# EAGLE design node (EAGLE 6.5.0)
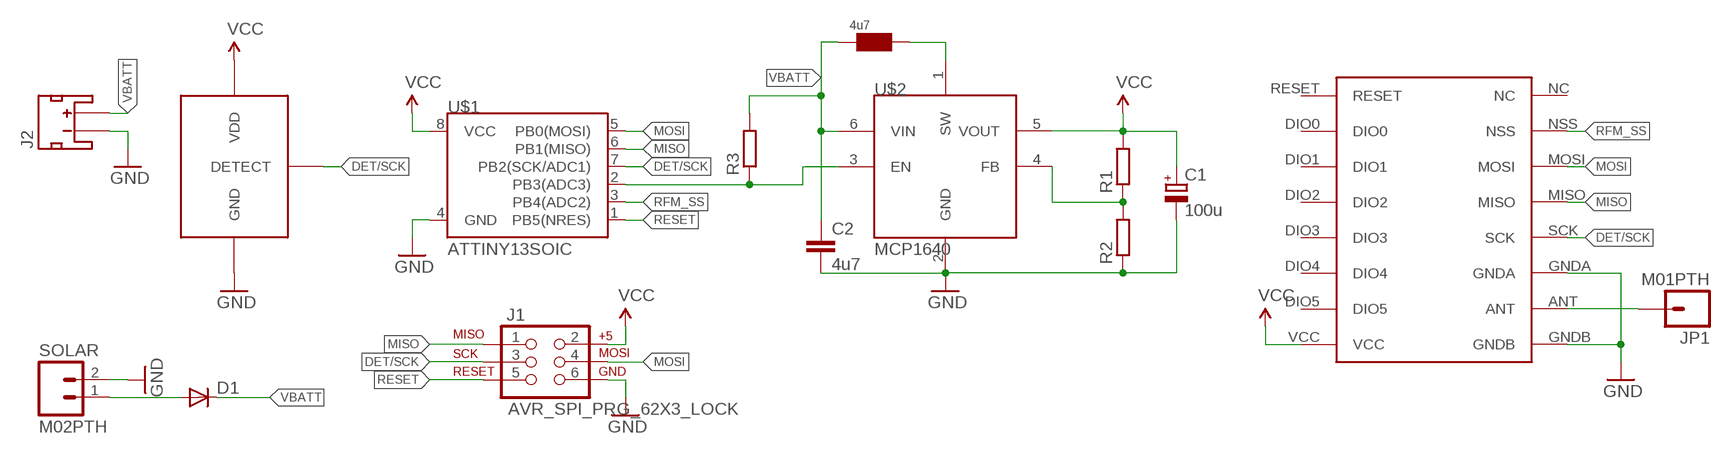
[diagram p0: schematic, sheet 1]

## Parts
C1  100u  CPOL-EUSANYO_SMD_C6  [SANYO-OSCON_SMD_C6]
C2  4u7  C-EUC0603  [C0603]
D1  DIODE-SOD123  [SOD123]
DF  4u7  BOURNS_SRN5040  [BOURNS_SRN5040_L]
J1  AVR_SPI_PRG_62X3_LOCK  [2X3_LOCK]
J2  JST_2MM_MALE_TH  [JST-2-TH]
JP1  M01PTH  [1X01]
R1  R-EU_R0603  [R0603]
R2  R-EU_R0603  [R0603]
R3  R-EU_R0603  [R0603]
SOLAR  M02PTH  [1X02]
U$1  ATTINY13SOIC  [SO08]
U$2  MCP1640  [SOT23-6]
U$3  BU49X_VDET_SOT235  [SOT23-5L]
U$4  RFM69HW  [RFM]

## Nets
DET/SCK: J1.3 U$1.7(PB2(SCK/ADC1)) U$3.1(DETECT) U$4.SCK
GND: C1.- C2.2 J1.6 J2.2(-) R2.1 SOLAR.2 U$1.4(GND) U$2.2(GND) U$3.3(GND) U$4.GNDA U$4.GNDB
MISO: J1.1 U$1.6(PB1(MISO)) U$4.MISO
MOSI: J1.4 U$1.5(PB0(MOSI)) U$4.MOSI
N$1: DF.P$2 U$2.1(SW)
N$2: R1.1 R2.2 U$2.4(FB)
N$3: JP1.1 U$4.ANT
N$4: R3.1 U$1.2(PB3(ADC3)) U$2.3(EN)
N$5: D1.A SOLAR.1
RESET: J1.5 U$1.1(PB5(NRES))
RFM_SS: U$1.3(PB4(ADC2)) U$4.NSS
VBATT: C2.1 D1.C DF.P$1 J2.1(+) R3.2 U$2.6(VIN)
VCC: C1.+ J1.2 R1.2 U$1.8(VCC) U$2.5(VOUT) U$3.2(VDD) U$4.VCC
Unconnected: U$4.DIO0 U$4.DIO1 U$4.DIO2 U$4.DIO3 U$4.DIO4 U$4.DIO5 U$4.NC U$4.RESET

## Library data of the parts
C1 = rcl:CPOL-EU: POLARIZED CAPACITOR, European symbol
C2 = rcl:C-EU: CAPACITOR, European symbol
D1 = dtb:DIODE-: DIODE
DF = jonsowman:BOURNS_SRN5040
J1 = SparkFun-Connectors:AVR_SPI_PRG_6: AVR ISP 6 Pin This is the reduced ISP connector for AVR programming. Common on Arduino. This footprint will take up less PCB space and can be used with a 10-pin to 6-pin adapter such as SKU: BOB-08508 **Special note about "TEST_POINT" package. The stop mask is on the top side, so if you want your programming test points to be on the bottom of your board, make sure to place this package on the bottom side of the board. This also ensure that the orientation to program from the bottom side will be correct.
J2 = dtb:JST_2MM_MALE_TH: Mates to single-cell LiPo batteries. CONN-08352
JP1 = SparkFun-Connectors:M01: Header 1 Standard 1-pin 0.1" header. Use with straight break away headers (SKU : PRT-00116), right angle break away headers (PRT-00553), swiss pins (PRT-00743), machine pins (PRT-00117), and female headers (PRT-00115).
R1-R3 = rcl:R-EU_: RESISTOR, European symbol
SOLAR = SparkFun-Connectors:M02: Standard 2-pin 0.1" header. Use with - straight break away headers ( PRT-00116) - right angle break away headers (PRT-00553) - swiss pins (PRT-00743) - machine pins (PRT-00117) - female headers (PRT-00115) Molex polarized connector foot print use with: PRT-08233 with associated crimp pins and housings. 2.54_SCREWTERM for use with PRT-10571. 3.5mm Screw Terminal footprints for PRT-08084 5mm Screw Terminal footprints for use with PRT-08432
U$1 = SparkFun-DigitalIC:ATTINY13: Atmel 8-pin 1kB flash uC
U$2 = ukhas:MCP1640
U$3 = jonsowman:BU49X_VDET_SOT235
U$4 = hoperf:RFM69HW

## Board
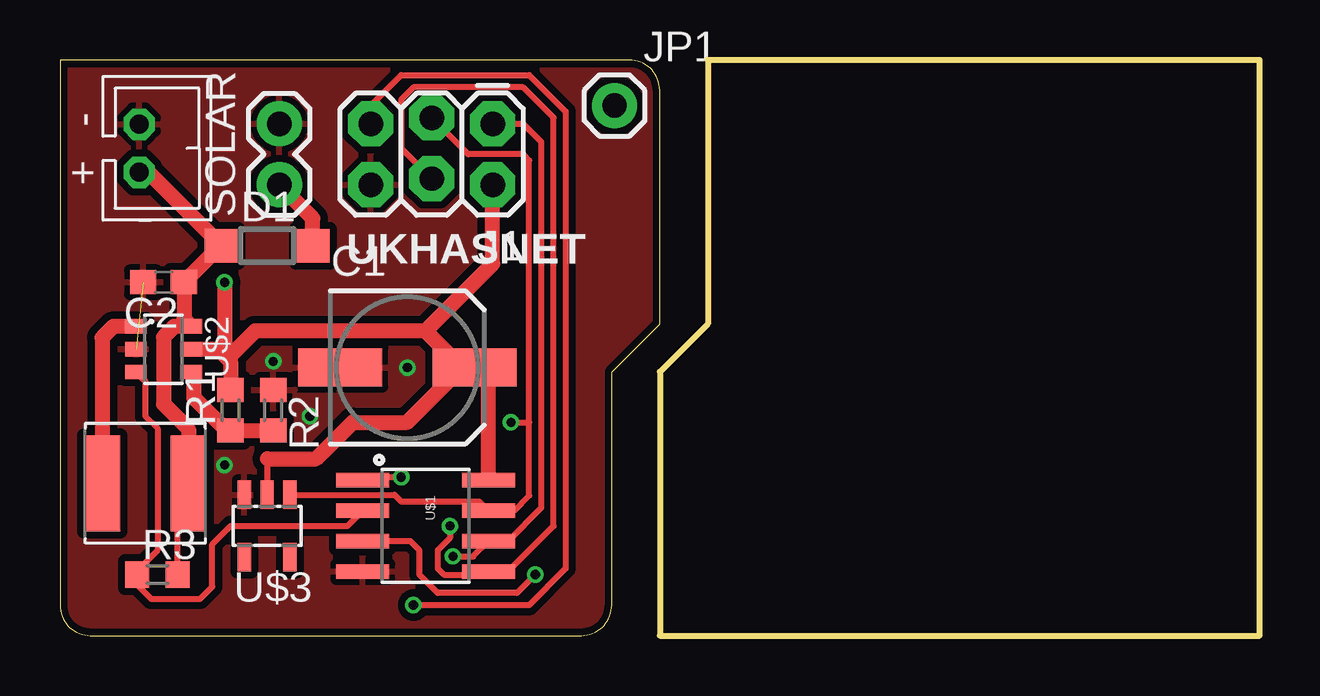
[diagram p1: board, top side]
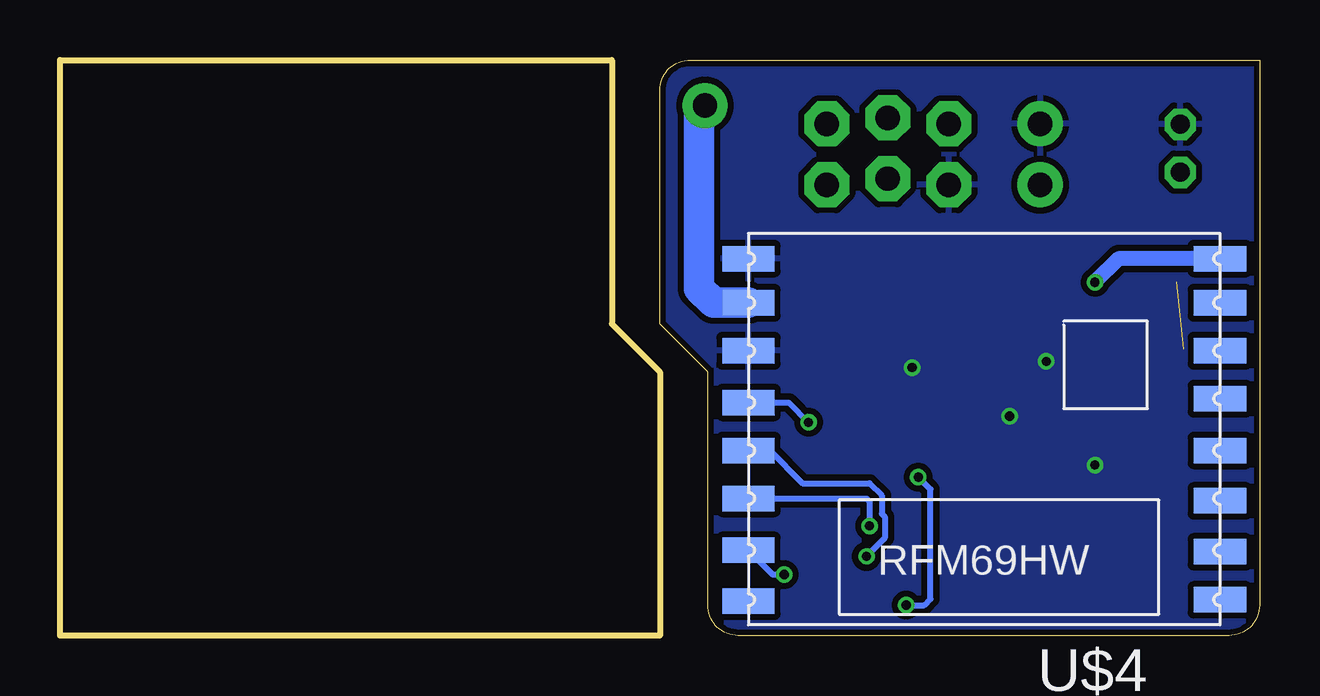
[diagram p2: board, bottom side, seen from below]

Size 50 x 24 mm. Coordinates in mm from the lower left corner, seen from the top.
Outline: 25,13 25,22.73 arc90 23.73,24 0,24 arc90 0,24 0,1.27 arc90 1.27,0 21.73,0 arc90 23,1.27 23,11 25,13
Outline: 27,24 27,13 25,11 25,0 50,0 50,24 27,24
Copper layers (1*16): Top 0.035mm / dielectric 1.5mm / Bottom 0.035mm
Design rules "SeeedStudio_rule_no_angle_090911": minimum track width 6mil, minimum drill 12mil, track to track 6mil, track to pad 6mil, pad to pad 6mil, via to via 6mil, smd to smd 0mil, copper to edge 10mil, drill to drill 10mil, minimum pad ring 10mil, minimum via ring 6mil, stop-mask expansion 2mil, vias tented up to drill 100mil, thermal gap 10mil

### Footprints (pad centres in the part's own frame; a part is rotated, then mirrored left to right if it is on the bottom)
SANYO-OSCON_SMD_C6 = smd 3.5 x 1.6: + 2.8,0; - -2.8,0
C0603 = smd 1.1 x 1: 1 -0.85,0; 2 0.85,0
SOD123 = smd 1.4 x 1.4: A 1.9,0; C -1.9,0
BOURNS_SRN5040_L = smd 1.5 x 4: P$1 -1.8,0; P$2 1.8,0
2X3_LOCK = drill 1.016 pad 1.88 octagon: 1 0,0; 2 0,2.54; 3 2.54,-0.254; 4 2.54,2.286; 5 5.08,0; 6 5.08,2.54
JST-2-TH = drill 0.8 octagon: 1 1,0; 2 -1,0
1X01 = drill 1.016 pad 1.88: 1 0,0
R0603 = smd 1 x 1.1: 1 -0.85,0; 2 0.85,0
1X02 = drill 1.016 pad 1.88: 1 0,0; 2 2.54,0
SO08 = smd 0.61 x 2.21: 1 -1.905,-2.616; 2 -0.635,-2.616; 3 0.635,-2.616; 4 1.905,-2.616; 5 1.905,2.616; 6 0.635,2.616; 7 -0.635,2.616; 8 -1.905,2.616
SOT23-6 = smd 0.6 x 0.9: 1 -0.95,-1.15; 2 0,-1.15; 3 0.95,-1.15; 4 0.95,1.15; 5 0,1.15; 6 -0.95,1.15
SOT23-5L = smd 0.55 x 1.2: 1 -0.95,-1.3; 2 0,-1.3; 3 0.95,-1.3; 4 0.95,1.3; 5 -0.95,1.3
RFM = smd 2.184 x 1.067: ANT 19.651,2.889; DIO0 0,13.27; DIO1 0,11.143; DIO2 0,9.047; DIO3 0,6.889; DIO4 0,4.889; DIO5 0,2.889; GNDA 19.651,4.889; GNDB 19.651,1.048; MISO 19.651,9.047; MOSI 19.651,11.047; NC 19.651,15.334; NSS 19.651,13.206; RESET 0,15.27; SCK 19.651,7.048; VCC 0,1.048

### Placement (x,y rotation side)
C1  14.48,11.18 0 top
C2  4.32,14.73 180 top
D1  8.64,16.26 0 top
DF  3.56,6.35 180 top
J1  18.03,21.34 180 top
J2  3.3,20.32 270 top
JP1  23.11,22.1 0 top
R1  7.11,9.4 90 top
R2  8.89,9.4 270 top
R3  4.06,2.54 0 top
SOLAR  9.14,18.8 90 top
U$1  15.24,4.57 270 top
U$2  4.32,11.94 270 top
U$3  8.64,4.57 180 top
U$4  1.65,16.76 180 bottom

### Tracks (layer width: path | path; a pad name or v marks a point on that pad's centre or on a via)
DET/SCK  (via drill 0.38)
  Top 0.254: 19.56,8.89 19.56,5.84 18.92,5.21 U$1.7 17.48,5.59 14.22,5.59 13.94,5.87 U$3.1 | 19.56,8.89 19.56,19.81 19.3,20.07 17.02,20.07 J1.3 | v18.8,8.89 19.56,8.89
  Bottom 0.254: U$4.SCK 19.62,9.72 v18.8,8.89
GND  (via drill 0.38)  (1 unrouted)
  other vias: 6.86,7.11 8.89,11.43 14.48,11.18 10.41,9.14
  pour Top (isolate 0.305): 0,0 23.11,0 23.11,10.92 23.11,11.18 24.89,12.95 24.89,23.88 0,23.88
  pour Bottom (isolate 0.254): 0,23.88 0,0 23.11,0 23.11,11.18 24.89,12.95 24.89,24.13 0.25,24.13 arc90
MISO  (via drill 0.38)
  Top 0.254: J1.1 19.3,21.34 20.07,20.57 20.07,5.33 18.67,3.94 U$1.6 17.22,3.3 v16.38,3.3
  Bottom 0.254: U$4.MISO 20.42,7.72 19.05,6.35 16.26,6.35 15.75,5.84 15.75,5.08 15.62,4.95 15.62,4.06 v16.38,3.3
MOSI  (via drill 0.38)
  Top 0.254: U$1.5 18.67,2.67 20.57,4.57 20.57,21.59 19.3,22.86 14.73,22.86 14.22,22.35 14.22,20.32 J1.4 | 17.73,2.79 U$1.5 | v16.26,4.57 16.26,4.06 15.75,3.56 15.75,2.79 16,2.54 17.73,2.54 U$1.5
  Bottom 0.254: U$4.MOSI 16.38,5.72 16.26,5.59 v16.26,4.57
N$1
  Top 0.635: U$2.1 2.22,12.89 1.76,12.42 DF.P$2 1.52,6.12
N$2
  Top 0.635: U$2.4 5.59,10.87 5.59,9.91 6.95,8.55 R1.1 R2.2
N$3
  Bottom 1.27: U$4.ANT 22.77,13.88 23.37,14.48 23.37,21.84 JP1.1
N$4
  Top 0.254: 3.17,2.59 R3.1 | R3.1 3.21,2.12 3.81,1.52 5.84,1.52 6.35,2.03 6.35,3.81 7.11,4.57 11.99,4.57 U$1.2 | U$2.3 3.56,10.6 3.56,9.14 4.06,8.64 4.06,3.56 3.21,2.71 R3.1
N$5
  Top 0.635: D1.A 10.54,17.4 SOLAR.1
RESET  (via drill 0.38)
  Top 0.254: 12.5,6.6 U$1.1 12.75,6.6 v14.22,6.6 | J1.5 12.95,22.1 14.22,23.37 19.56,23.37 21.08,21.84 21.08,2.79 19.56,1.27 v14.73,1.27
  Bottom 0.254: v14.73,1.27 13.97,1.27 13.72,1.52 13.72,6.1 v14.22,6.6
RFM_SS  (via drill 0.38)
  Top 0.254: 11.81,3.94 U$1.3 14.61,3.94 14.99,3.56 14.99,2.54 15.75,1.78 19.05,1.78 v19.81,2.54
  Bottom 0.254: v19.81,2.54 20.29,2.54 U$4.NSS
VBATT
  Top 0.254: 4.94,7.28 5.1,7.11 | R3.2 4.91,6.67 5.1,6.86
  Top 0.635: 5.1,7.11 5.1,6.86 DF.P$1 5.36,8.61 4.32,9.65 4.32,12.45 4.76,12.89 U$2.6 5.17,13.19 C2.1 6.69,16.26 D1.C 3.67,19.32 J2.1
VCC  (via drill 0.38)
  Top 0.254: 8.64,7.37 U$3.2
  Top 0.635: U$2.5 6.6,11.94 | 6.6,11.94 6.99,11.56 | 6.99,11.56 7.11,11.43 R1.2 | 16.76,11.18 C1.+ 17.86,10.6 U$1.8 | 16.76,11.18 15.24,12.7 | 15.24,12.7 8.13,12.7 6.99,11.56 | 15.24,12.7 18.03,15.49 J1.2 | 8.64,7.37 10.67,7.37 12.19,8.89 14.48,8.89 16.76,11.18 | v6.86,14.73 6.86,12.19 6.6,11.94
  Bottom 0.635: U$4.VCC 5.87,15.72 v6.86,14.73

### Text on the board
tPlace: UKHASNET